# Altium schematic sheet Architecture.SchDoc
size A
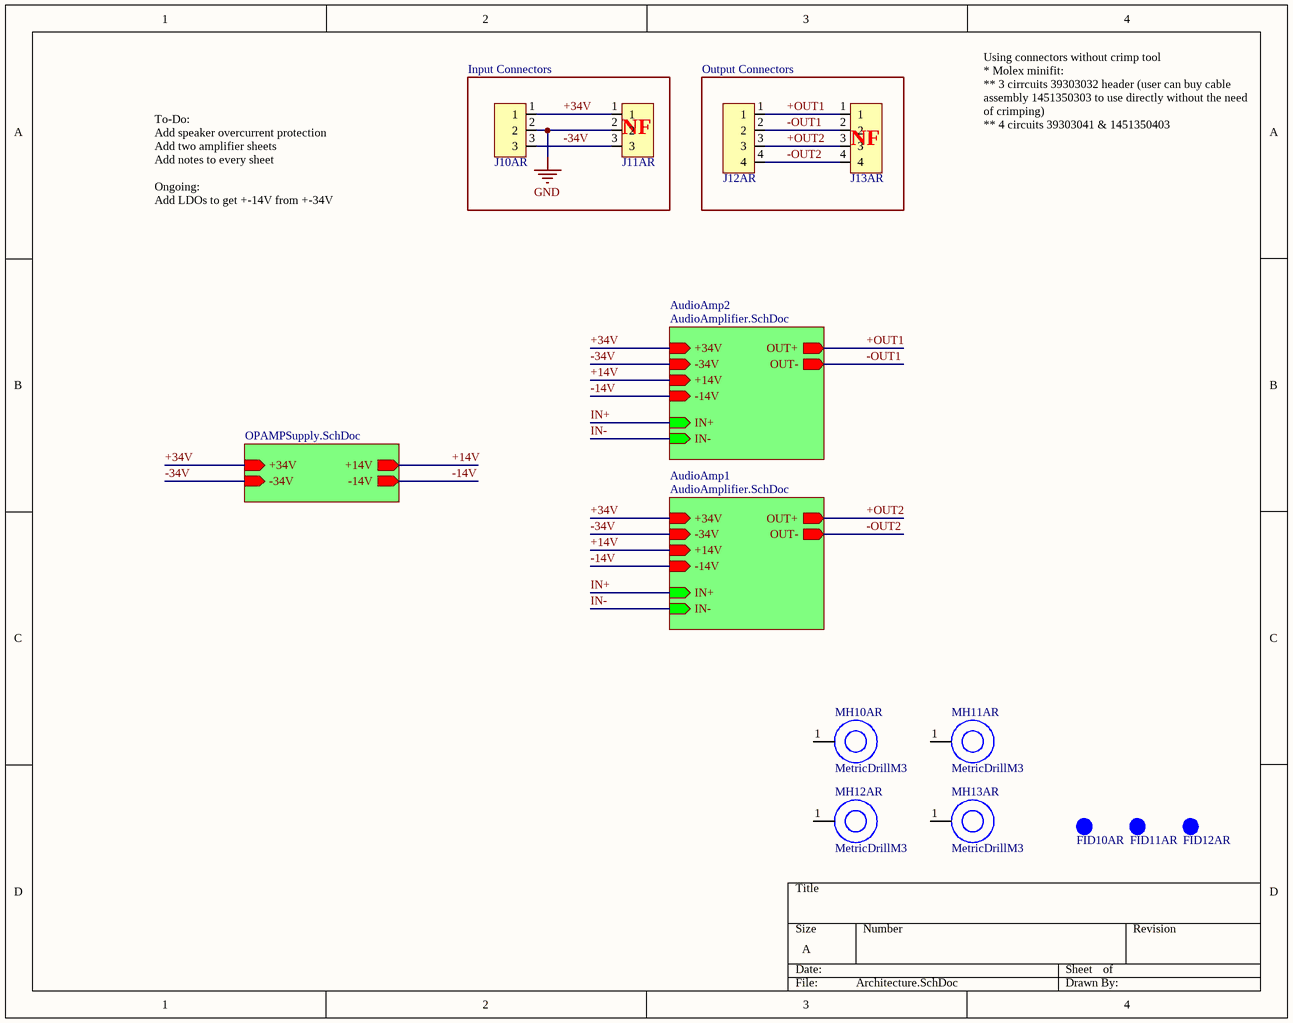
[diagram p0: Architecture.SchDoc]

## Parts
FID10AR  FIDUCIAL_1mm  [FID_1mm]  (value not drawn)  (no BOM)
FID11AR  FIDUCIAL_1mm  [FID_1mm]  (value not drawn)  (no BOM)
FID12AR  FIDUCIAL_1mm  [FID_1mm]  (value not drawn)  (no BOM)
J10AR  282836-3  [282836-3_TYC]  (value not drawn)
J11AR  39-30-3032  [CON_39303032]  (value not drawn)
J12AR  282836-4  [282836-4_TYC]  (value not drawn)
J13AR  39-30-3041  [CON_39303041]  (value not drawn)
MH10AR  MetricDrillM3  [MetricM3Hole]  (no BOM)
MH11AR  MetricDrillM3  [MetricM3Hole]  (no BOM)
MH12AR  MetricDrillM3  [MetricM3Hole]  (no BOM)
MH13AR  MetricDrillM3  [MetricM3Hole]  (no BOM)

## Blocks framed on the sheet
NF: J10AR J11AR
NF: J12AR J13AR

## Sub-sheets
AudioAmp1 = AudioAmplifier.SchDoc: OUT- (out), OUT+ (out), -34V (in), +34V (in), -14V (in), +14V (in), IN- (in), IN+ (in)
AudioAmp2 = AudioAmplifier.SchDoc: OUT- (out), OUT+ (out), -34V (in), +34V (in), -14V (in), +14V (in), IN- (in), IN+ (in)
OASupply = OPAMPSupply.SchDoc: +34V (in), -14V (out), +14V (out), -34V (in)

## Nets
GND: J10AR.2 J11AR.2
+14V: sheet AudioAmp2/+14V, sheet OASupply/+14V, sheet AudioAmp1/+14V
+34V: J10AR.1 J11AR.1 ; sheet AudioAmp2/+34V, sheet OASupply/+34V, sheet AudioAmp1/+34V
+OUT1: J12AR.1 J13AR.1 ; sheet AudioAmp2/OUT+
+OUT2: J12AR.3 J13AR.3 ; sheet AudioAmp1/OUT+
-14V: sheet AudioAmp2/-14V, sheet OASupply/-14V, sheet AudioAmp1/-14V
-34V: J10AR.3 J11AR.3 ; sheet AudioAmp2/-34V, sheet OASupply/-34V, sheet AudioAmp1/-34V
-OUT1: J12AR.2 J13AR.2 ; sheet AudioAmp2/OUT-
-OUT2: J12AR.4 J13AR.4 ; sheet AudioAmp1/OUT-
IN+: sheet AudioAmp2/IN+, sheet AudioAmp1/IN+
IN-: sheet AudioAmp2/IN-, sheet AudioAmp1/IN-

Not connected (* = marked no-connect by the designer): MH10AR 1; MH11AR 1; MH12AR 1; MH13AR 1

## Notes on the sheet
- (near J10AR) Input Connectors
- Output Connectors
- Using connectors without crimp tool
  * Molex minifit:
  ** 3 cirrcuits 39303032 header (user can buy cable assembly 1451350303 to use directly without the need of crimping)
  ** 4 circuits 39303041 & 1451350403
- To-Do:
  Add speaker overcurrent protection
  Add two amplifier sheets
  Add notes to every sheet
  Ongoing:
  Add LDOs to get +-14V from +-34V

## Library data of the parts
FID10AR FID11AR FID12AR = FIDUCIAL_1mm: FIDUCIAL_1mm 40 mil diam120mil mask
J10AR = 282836-3: Connector, Terminal Block; Wire Receptacle; 3 Pos.; 16-30 AWG; 0.197 in. CL; Sid; Manufacturer: TE Connectivity; Supplier 1: Arrow Electronics; Manufacturer Part Number: 282836-3; RoHS: Yes; Category: Terminal Blocks; Stock 1: 17595; Pricing 1: 1=1.07040, 10=0.71690, 100=0.59380, 600=0.59230, 1000=0.53630, 4800=0.50760 (USD); ComponentLink1URL: https://datasheet.ciiva.com/16305/eng-cs-1308389-eurostyle-terminal-blocks-0607-16305242.pdf?src-supplier=Future+Electronics; ComponentLink1Description: https://datasheet.ciiva.com/16305/eng-cs-1308389-eurostyle-terminal-blocks-0607-16305242.pdf?src-supplier=Future+Electronics; ComponentLink2URL: https://datasheet.ciiva.com/15169/getdatasheetpartid-155856-15169554.pdf?src-supplier=Verical; ComponentLink2Description: https://datasheet.ciiva.com/15169/getdatasheetpartid-155856-15169554.pdf?src-supplier=Verical; ComponentLink3URL: https://datasheet.ciiva.com/19460/750661-19460522.pdf?src-supplier=Jameco; ComponentLink3Description: https://datasheet.ciiva.com/19460/750661-19460522.pdf?src-supplier=Jameco; ComponentLink4URL: https://datasheet.ciiva.com/11757/0900766b8002dc8a-11757406.pdf?src-supplier=RSComponents; ComponentLink4Description: https://datasheet.ciiva.com/11757/0900766b8002dc8a-11757406.pdf?src-supplier=RSComponents; ComponentLink5URL: https://datasheet.ciiva.com/30106/eng-cs-1308389-eurostyle-terminal-blocks-0607-30106198.pdf?src-supplier=Onlinecomponents.com; ComponentLink5Description: https://datasheet.ciiva.com/30106/eng-cs-1308389-eurostyle-terminal-blocks-0607-30106198.pdf?src-supplier=Onlinecomponents.com; ComponentLink6URL: https://datasheet.ciiva.com/14606/70086276-14606907.pdf?src-supplier=Allied+Electronics; ComponentLink6Description: https://datasheet.ciiva.com/14606/70086276-14606907.pdf?src-supplier=Allied+Electronics; ComponentLink7URL: https://datasheet.ciiva.com/3141/eng-cs-1308389-eurostyle-terminal-blocks-0607-3141119.pdf?src-supplier=Avnet; ComponentLink7Description: https://datasheet.ciiva.com/3141/eng-cs-1308389-eurostyle-terminal-blocks-0607-3141119.pdf?src-supplier=Avnet; ComponentLink8URL: https://datasheet.ciiva.com/823/eng-cd-282836-h10-823445.pdf?src-supplier=Digi-Key; ComponentLink8Description: https://datasheet.ciiva.com/823/eng-cd-282836-h10-823445.pdf?src-supplier=Digi-Key
J11AR = 39-30-3032: Conn Power HDR 3 POS 4.2mm Solder RA Thru-Hole 3 Terminal 1 Port Mini-Fit Jr™ Frame; Manufacturer: Molex; Supplier 1: Farnell; Manufacturer Part Number: 39-30-3032; RoHS: Yes; Category: Headers and Wire Housings; Stock 1: 6; Pricing 1: 1=1.33000, 10=1.22000, 50=1.10000, 100=0.91400, 500=0.82300, 1000=0.73100 (EUR); ComponentLink1URL: https://datasheet.ciiva.com/5155/0039303032-pcb-headers-160103-5155392.pdf?src-supplier=Mouser; ComponentLink1Description: https://datasheet.ciiva.com/5155/0039303032-pcb-headers-160103-5155392.pdf?src-supplier=Mouser; ComponentLink2URL: https://datasheet.ciiva.com/30191/34870039303032-pcb-headers-30191281.pdf?src-supplier=Onlinecomponents.com; ComponentLink2Description: https://datasheet.ciiva.com/30191/34870039303032-pcb-headers-30191281.pdf?src-supplier=Onlinecomponents.com
J12AR = 282836-4: Connector, Terminal Block; Wire Receptacle; 4 Pos.; 16-30 AWG; 0.197 in. CL; Sid; Manufacturer: TE Connectivity; Supplier 1: Arrow Electronics; Manufacturer Part Number: 282836-4; RoHS: Yes; Category: Terminal Blocks; Stock 1: 3440; Pricing 1: 1=0.88110, 10=0.77090, 100=0.67770, 500=0.64840, 1000=0.59210, 2500=0.54780, 5000=0.37260, 10000=0.36880 (USD); ComponentLink1URL: https://datasheet.ciiva.com/19460/750670-19460514.pdf?src-supplier=Jameco; ComponentLink1Description: https://datasheet.ciiva.com/19460/750670-19460514.pdf?src-supplier=Jameco; ComponentLink2URL: https://datasheet.ciiva.com/11757/0900766b8002dc8a-11757430.pdf?src-supplier=RSComponents; ComponentLink2Description: https://datasheet.ciiva.com/11757/0900766b8002dc8a-11757430.pdf?src-supplier=RSComponents; ComponentLink3URL: https://datasheet.ciiva.com/823/eng-cd-282836-h10-823455.pdf?src-supplier=Digi-Key; ComponentLink3Description: https://datasheet.ciiva.com/823/eng-cd-282836-h10-823455.pdf?src-supplier=Digi-Key; ComponentLink4URL: https://datasheet.ciiva.com/3141/eng-cs-1308389-eurostyle-terminal-blocks-0607-3141577.pdf?src-supplier=Avnet; ComponentLink4Description: https://datasheet.ciiva.com/3141/eng-cs-1308389-eurostyle-terminal-blocks-0607-3141577.pdf?src-supplier=Avnet; ComponentLink5URL: https://datasheet.ciiva.com/26824/getdatasheetpartid-206193-26824087.pdf?src-supplier=Verical; ComponentLink5Description: https://datasheet.ciiva.com/26824/getdatasheetpartid-206193-26824087.pdf?src-supplier=Verical; ComponentLink6URL: https://datasheet.ciiva.com/30161/eng-cs-1308389-eurostyle-terminal-blocks-0607-30161594.pdf?src-supplier=Onlinecomponents.com; ComponentLink6Description: https://datasheet.ciiva.com/30161/eng-cs-1308389-eurostyle-terminal-blocks-0607-30161594.pdf?src-supplier=Onlinecomponents.com; ComponentLink7URL: https://datasheet.ciiva.com/14607/70086278-14607387.pdf?src-supplier=Allied+Electronics; ComponentLink7Description: https://datasheet.ciiva.com/14607/70086278-14607387.pdf?src-supplier=Allied+Electronics
J13AR = 39-30-3041: Conn Power HDR 4 POS 4.2mm Solder RA Thru-Hole 4 Terminal 1 Port Mini-Fit Jr™ Bag; Manufacturer: Molex; Supplier 1: Arrow Electronics; Manufacturer Part Number: 39-30-3041; RoHS: Yes; Category: Headers and Wire Housings; Stock 1: 12737; Pricing 1: 1=0.53590, 10=0.50510, 100=0.47270, 1000=0.43130, 5000=0.40490, 10000=0.39350 (USD); ComponentLink1URL: https://datasheet.ciiva.com/36179/152300039303041-pcb-headers-36179625.pdf?src-supplier=Onlinecomponents.com; ComponentLink1Description: https://datasheet.ciiva.com/36179/152300039303041-pcb-headers-36179625.pdf?src-supplier=Onlinecomponents.com; ComponentLink2URL: https://datasheet.ciiva.com/7843/1597503-7843936.pdf?src-supplier=Element14; ComponentLink2Description: https://datasheet.ciiva.com/7843/1597503-7843936.pdf?src-supplier=Element14
MH10AR MH11AR MH12AR MH13AR = MetricDrillM3: Mounting Hole Non Plated Metric 3